# Altium schematic sheet ft61f14x_test.SchDoc: sensor sample
size A4; Author: Bryan Guo; Revision: 1.0.2; SheetNumber: 1; SheetTotal: 2
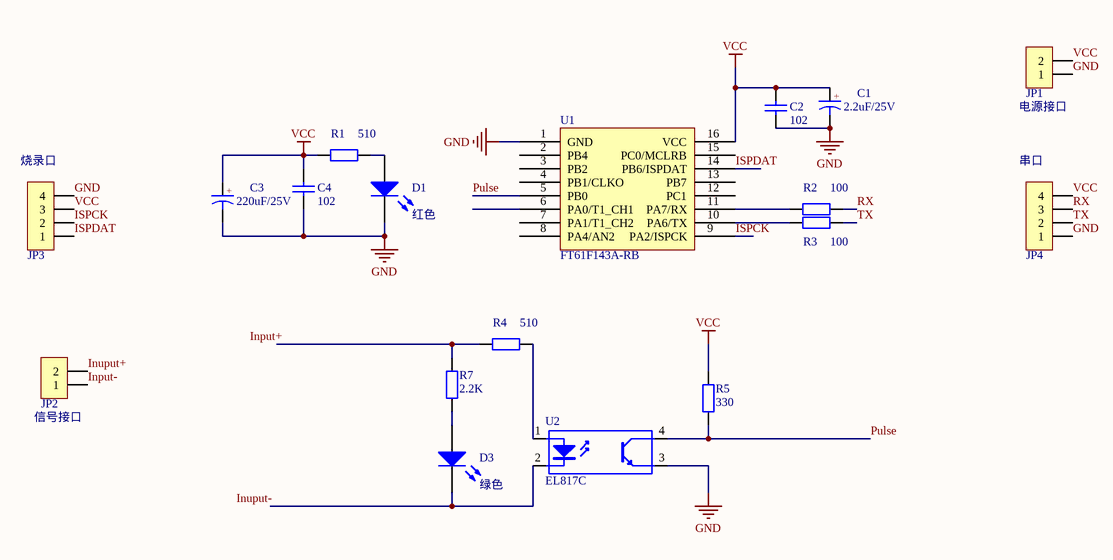
[diagram p0: ft61f14x_test.SchDoc]

## Parts
C1  2.2uF/25V  [CE-1.5*4*8]
C2  102  [C0805_L]
C3  220uF/25V  [CE-1.5*4*8]
C4  102  [C0805_L]
D1  红色  [LED0805_G]
D3  绿色  [LED0805_G]
JP1  HDR-1X2  [XH2.54-LI-2P]  (value not drawn)
JP2  HDR-1X2  [XH2.54-LI-2P]  (value not drawn)
JP3  HDR-1X4  [XH2.54-LI-4P]  (value not drawn)
JP4  HDR-1X4  [XH2.54-LI-4P]  (value not drawn)
R1  510  [R0805_L]
R2  100  [R0805_L]
R3  100  [R0805_L]
R4  510  [R0805_L]
R5  330  [R0805_L]
R7  2.2K  [R0805_L]
U1  FT61F143A-RB  [SO14]
U2  EL817C  [DIP-4]

## Nets
GND: C1.2 C2.1 C3.2 C4.1 D1.2(K) JP1.1 JP3.4 JP4.1 U1.1(GND) U2.3(E)
VCC: C1.1 C2.2 C3.1 C4.2 JP1.2 JP3.3 JP4.4 R1.1 R5.2 U1.16(VCC)
Input-: JP2.1
Inuput+: JP2.2
ISPCK: JP3.2 U1.9(PA2/ISPCK)
ISPDAT: JP3.1 U1.14(PB6/ISPDAT)
Pulse: R5.1 U1.5(PB0) U2.4(C)
RX: JP4.3 R2.1
TX: JP4.2 R3.1
NetD1_1: D1.1(A) R1.2
NetD3_1: D3.1(A) R7.2
NetD3_2: D3.2(K) U2.2(K)
NetR2_2: R2.2 U1.11(PA7/RX)
NetR3_2: R3.2 U1.10(PA6/TX)
NetR4_1: R4.1 R7.1
NetR4_2: R4.2 U2.1(A)

Not connected (* = marked no-connect by the designer): U1 2(PB4) 3(PB2) 4(PB1/CLKO) 6(PA0/T1_CH1) 7(PA1/T1_CH2) 8(PA4/AN2) 12(PC1) 13(PB7) 15(PC0/MCLRB)

## Notes on the sheet
- (near JP3) 烧录口
- (near JP4) 串口
- (near JP1) 电源接口
- (near JP2) 信号接口
- Labels drawn without touching a wire or pin: Input+, Inuput-
- (in symbol CE) +

## Library data of the parts
C1 C3 = CE: 直插电解电容; 当前库版本V2022.12.25 @淘宝卖家:黄晶宝石: 最新版本发布https://shop463601444.taobao.com; BOM名称: 直插电解电容
C2 C4 = C: 贴片电容/MLCC电容; BOM名称: 无极性贴片电容; 当前库版本V2022.12.25 @淘宝卖家:黄晶宝石: 最新版本发布https://shop463601444.taobao.com
D1 D3 = LED: 贴片LED; 封装库来自淘宝卖家：黄晶宝石: 其他店铺购入均为盗版封装库，无更新权益，请立即申请退款，本店现金奖励200~1000元; BOM名称: 贴片LED
JP1 JP2 = Header 2: 2P接插件; 联系卖家，免费查找封装: 唯一出售店铺网址https://shop463601444.taobao.com; 封装库来自淘宝卖家ID：黄晶宝石: 其他店铺购入均为盗版封装库，请立即申请退款，本店现金奖励50~200元; BOM名称: 2P接插件
JP3 JP4 = Header 4: 4P接插件; 联系卖家，免费查找封装: 唯一出售店铺网址https://shop463601444.taobao.com; 封装库来自淘宝卖家ID：黄晶宝石: 其他店铺购入均为盗版封装库，请立即申请退款，本店现金奖励50~200元; BOM名称: 4P接插件
R1-R5 R7 = R: 贴片电阻; 联系下单店铺卖家 免费帮你查找封装: 联系下单店铺卖家 免费技术支持; BOM名称: 贴片电阻
U2 = Optoisolator1: 4-Pin Phototransistor Optocoupler; Published: 24-Mar-1999; LatestRevisionDate: 04-Mar-2005; LatestRevisionNote: Sch pins 3 & 4 Swapped.; DatasheetVersion: Nov-2003; PackageReference: DIP-4; Publisher: Altium Limited